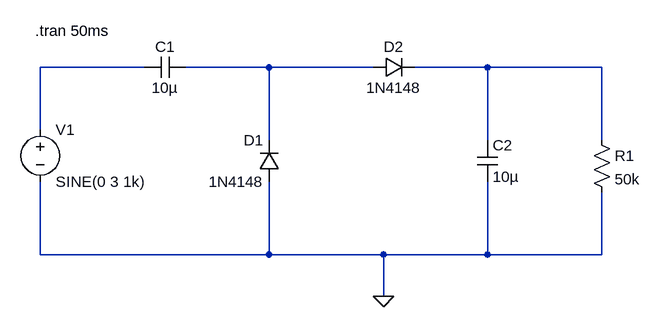
[diagram p0: schematic Voltage Doubler.asc]
Voltage Doubler.asc, the LTspice schematic file:
Version 4
SHEET 1 880 680
WIRE -304 48 -464 48
WIRE -112 48 -240 48
WIRE 48 48 -112 48
WIRE 224 48 112 48
WIRE 400 48 224 48
WIRE -464 144 -464 48
WIRE -112 160 -112 48
WIRE 224 160 224 48
WIRE 400 160 400 48
WIRE -464 336 -464 224
WIRE -112 336 -112 224
WIRE -112 336 -464 336
WIRE 64 336 -112 336
WIRE 224 336 224 224
WIRE 224 336 64 336
WIRE 400 336 400 240
WIRE 400 336 224 336
WIRE 64 400 64 336
FLAG 64 400 0
SYMBOL voltage -464 128 R0
WINDOW 123 0 0 Left 0
WINDOW 39 0 0 Left 0
SYMATTR InstName V1
SYMATTR Value SINE(0 3 1k)
SYMBOL cap -304 64 R270
WINDOW 0 32 32 VTop 2
WINDOW 3 0 32 VBottom 2
SYMATTR InstName C1
SYMATTR Value 10µ
SYMBOL diode -96 224 R180
WINDOW 0 24 64 Left 2
WINDOW 3 24 0 Left 2
SYMATTR InstName D1
SYMATTR Value 1N4148
SYMBOL diode 48 64 R270
WINDOW 0 32 32 VTop 2
WINDOW 3 0 32 VBottom 2
SYMATTR InstName D2
SYMATTR Value 1N4148
SYMBOL cap 208 160 R0
SYMATTR InstName C2
SYMATTR Value 10µ
SYMBOL res 384 144 R0
SYMATTR InstName R1
SYMATTR Value 50k
TEXT -472 -8 Left 2 !.tran 50ms

The netlist it stands for:
* Voltage Doubler.asc
V1 N001 0 SINE(0 3 1k)
C1 N001 N002 10µ
D1 0 N002 1N4148
D2 N002 N003 1N4148
C2 N003 0 10µ
R1 N003 0 50k
.model D D
.lib standard.dio
.tran 50ms
.backanno
.end